# EAGLE design main (EAGLE 5.06)
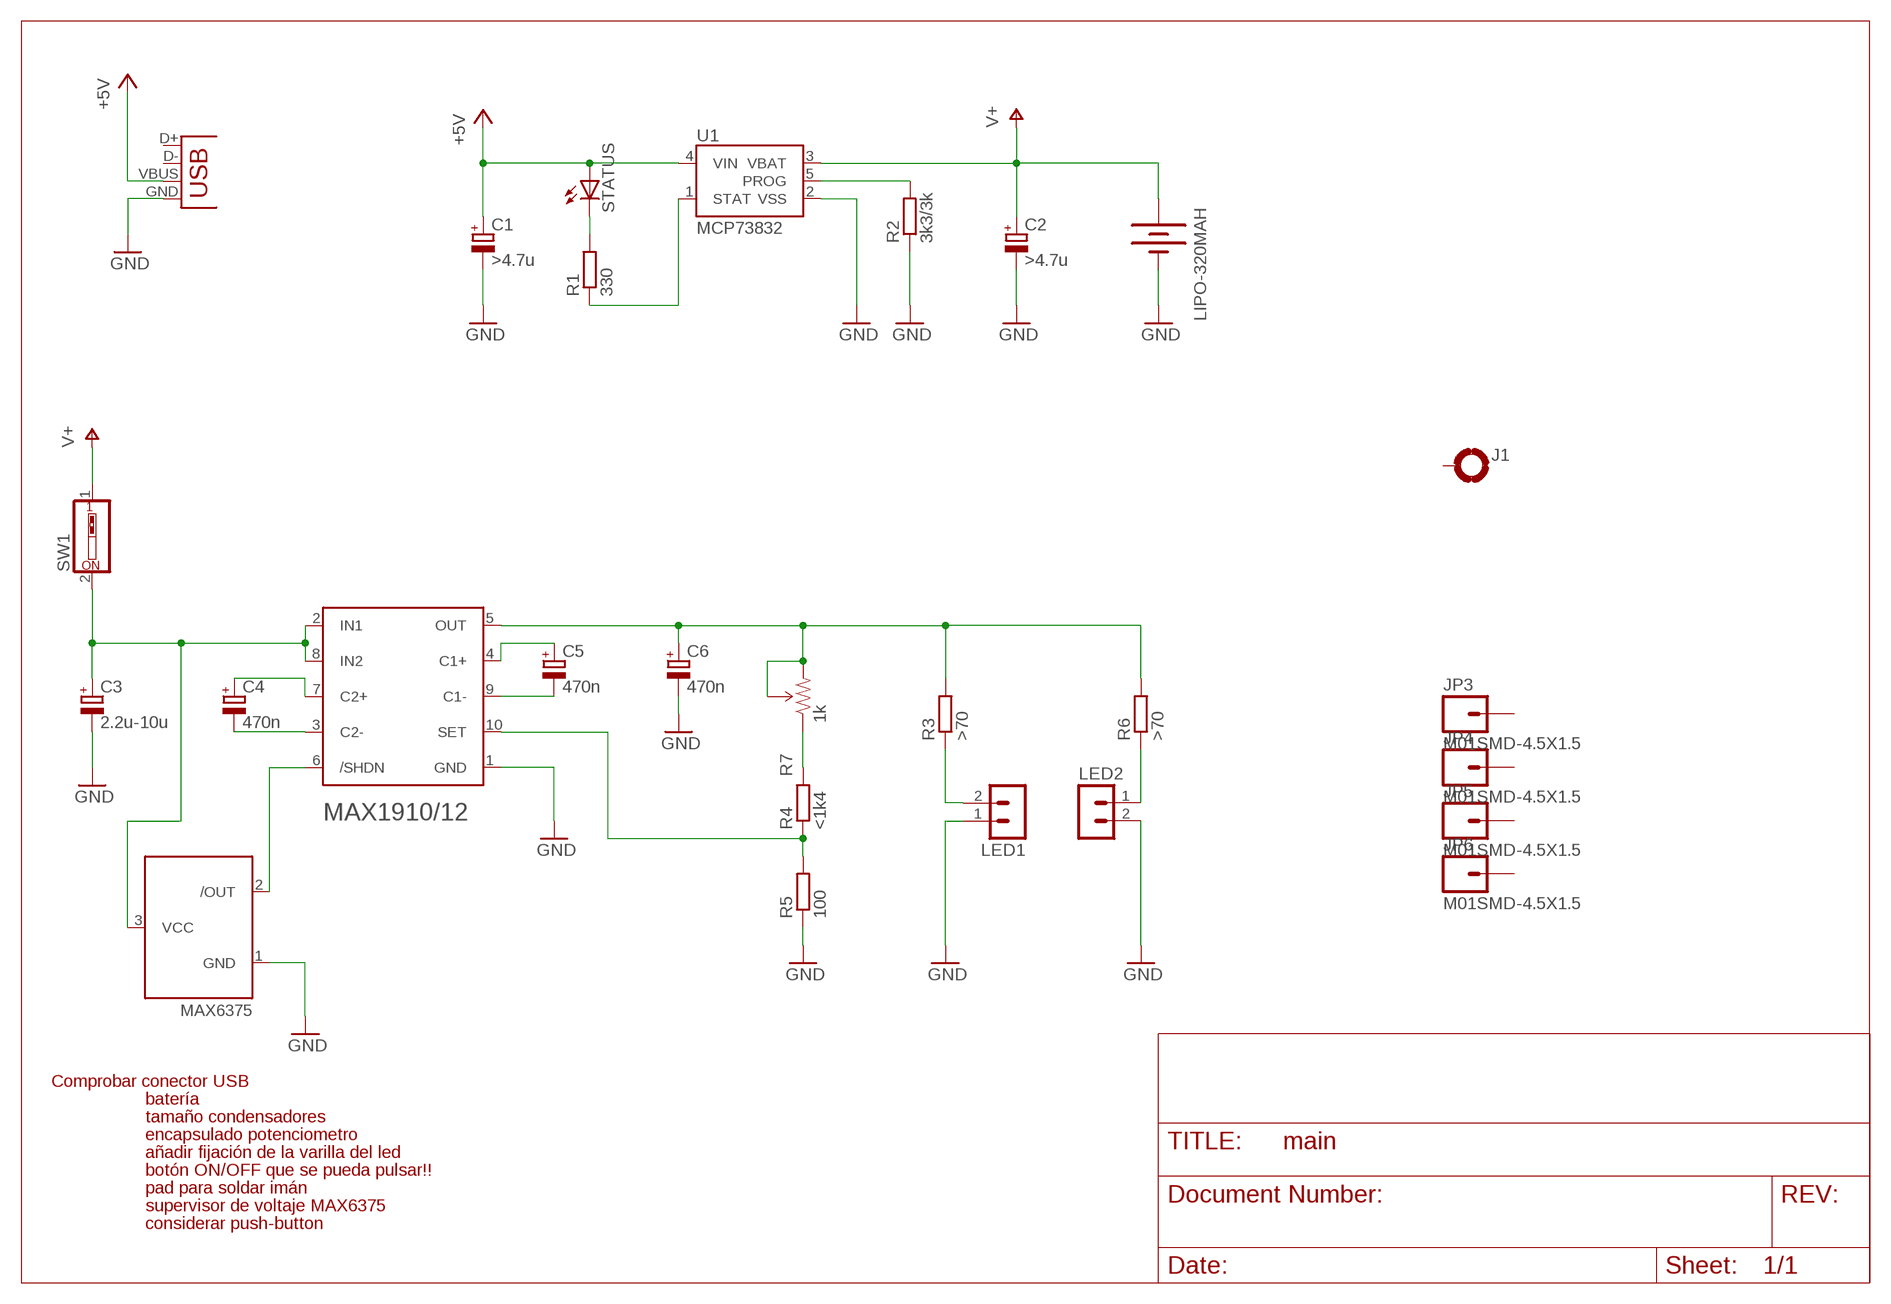
[diagram p0: schematic, sheet 1]

## Parts
C1  >4.7u  CPOL-EUSMCB  [SMC_B]
C2  >4.7u  CPOL-EUSMCB  [SMC_B]
C3  2.2u-10u  CPOL-EUSMCA  [SMC_A]
C4  470n  CPOL-EUSMCA  [SMC_A]
C5  470n  CPOL-EUSMCA  [SMC_A]
C6  470n  CPOL-EUSMCA  [SMC_A]
J1  STARBOARD_GND-SMALL2  [STARBOARD_GROUND_SMALL2]
JP3  M01SMD-4.5X1.5  [PAD-1.5X4.5]
JP4  M01SMD-4.5X1.5  [PAD-1.5X4.5]
JP5  M01SMD-4.5X1.5  [PAD-1.5X4.5]
JP6  M01SMD-4.5X1.5  [PAD-1.5X4.5]
LED1  MA02-1  [MA02-1W]
LED2  MA02-1  [MA02-1W]
LIPO-320MAH  BATTERY20PTH2  [BATTERY]
R1  330  R-EU_R1206  [R1206]
R2  3k3/3k  R-EU_R1206  [R1206]
R3  >70  R-EU_R1206  [R1206]
R4  <1k4  R-EU_R1206  [R1206]
R5  100  R-EU_R1206  [R1206]
R6  >70  R-EU_R1206  [R1206]
R7  1k  TRIMPOTPTH  [TRIM_POT_PTH]
STATUS  LEDCHIPLED_1206  [CHIPLED_1206]
SW1  SW_DIP-1  [EDG-01]
U1  MCP73832  [SOT23-5]
U$1  MAX1910/12  [UMAX/USOP_10L]
U$2  MAX6375  [SC70-3-W]
X3  USB-MICROB  [USB-MICROB]

## Nets
+5V: C1.+ STATUS.A U1.4(VIN) X3.VBUS
GND: C1.- C2.- C3.- C6.- LED1.1 LED2.2 LIPO-320MAH.- R2.1 R5.1 U1.2(VSS) U$1.1(GND) U$2.1(GND) X3.GND
N$1: C3.+ SW1.2 U$1.2(IN1) U$1.8(IN2) U$2.3(VCC)
N$2: R1.2 STATUS.C
N$3: R2.2 U1.5(PROG)
N$4: R1.1 U1.1(STAT)
N$5: C4.- U$1.3(C2-)
N$6: C4.+ U$1.7(C2+)
N$7: C5.- U$1.9(C1-)
N$8: C5.+ U$1.4(C1+)
N$9: LED2.1 R6.1
N$10: LED1.2 R3.1
N$11: C6.+ R3.2 R6.2 R7.2(WIPER) R7.3(CW) U$1.5(OUT)
N$12: R4.1 R5.2 U$1.10(SET)
N$13: R4.2 R7.1(CCW)
N$15: U$1.6(/SHDN) U$2.2(/OUT)
V+: C2.+ LIPO-320MAH.+ SW1.1 U1.3(VBAT)
Unconnected: J1.GROUND(MOUNT) JP3.P$1 JP4.P$1 JP5.P$1 JP6.P$1 X3.D+ X3.D-

## Notes on the sheet
- Comprobar conector USB
- batería
- tamaño condensadores
- encapsulado potenciometro
- añadir fijación de la varilla del led
- botón ON/OFF que se pueda pulsar!!
- pad para soldar imán
- supervisor de voltaje MAX6375
- considerar push-button

## Library data of the parts
C1-C6 = rcl:CPOL-EU: POLARIZED CAPACITOR, European symbol
J1 = SparkFun:STARBOARD_GND: StarBoard ground Pad Starboard pads sans the star cutout in top layer
JP3-JP6 = SparkFun:M01: Header 1 Standard 1-pin 0.1" header. Use with straight break away headers (SKU : PRT-00116), right angle break away headers (PRT-00553), swiss pins (PRT-00743), machine pins (PRT-00117), and female headers (PRT-00115).
LED1 LED2 = dan:MA02-1
LIPO-320MAH = SparkFun:BATTERY: Battery Holders Various common sizes : AA, AAA, 20mm coin cell and 12mm coin cell.
R1-R6 = rcl:R-EU_: RESISTOR, European symbol
R7 = SparkFun:TRIMPOT
STATUS = led:LED: LED OSRAM: - CHIPLED LG R971, LG N971, LY N971, LG Q971, LY Q971, LO R971, LY R971 LH N974, LH R974 LS Q976, LO Q976, LY Q976 LO Q996 - Hyper CHIPLED LW Q18S LB Q993, LB Q99A, LB R99A - SideLED LS A670, LO A670, LY A670, LG A670, LP A670 LB A673, LV A673, LT A673, LW A673 LH A674 LY A675 LS A676, LA A676, LO A676, LY A676, LW A676 LS A679, LY A679, LG A679 - Hyper Micro SIDELED® LS Y876, LA Y876, LO Y876, LY Y876 LT Y87S - SmartLED LW L88C, LW L88S LB L89C, LB L89S, LG L890 LS L89K, LO L89K, LY L89K LS L896, LA L896, LO L896, LY L896 - TOPLED LS T670, LO T670, LY T670, LG T670, LP T670 LSG T670, LSP T670, LSY T670, LOP T670, LYG T670 LG T671, LOG T671, LSG T671 LB T673, LV T673, LT T673, LW T673 LH T674 LS T676, LA T676, LO T676, LY T676, LB T676, LH T676, LSB T676, LW T676 LB T67C, LV T67C, LT T67C, LS T67K, LO T67K, LY T67K, LW E67C LS E67B, LA E67B, LO E67B, LY E67B, LB E67C, LV E67C, LT E67C LW T67C LS T679, LY T679, LG T679 LS T770, LO T770, LY T770, LG T770, LP T770 LB T773, LV T773, LT T773, LW T773 LH T774 LS E675, LA E675, LY E675, LS T675 LS T776, LA T776, LO T776, LY T776, LB T776 LHGB T686 LT T68C, LB T68C - Hyper Mini TOPLED® LB M676 - Mini TOPLED Santana® LG M470 LS M47K, LO M47K, LY M47K Source: http://www.osram.convergy.de LUXEON: - LUMILED® LXK2-PW12-R00, LXK2-PW12-S00, LXK2-PW14-U00, LXK2-PW14-V00 LXK2-PM12-R00, LXK2-PM12-S00, LXK2-PM14-U00 LXK2-PE12-Q00, LXK2-PE12-R00, LXK2-PE12-S00, LXK2-PE14-T00, LXK2-PE14-U00 LXK2-PB12-K00, LXK2-PB12-L00, LXK2-PB12-M00, LXK2-PB14-N00, LXK2-PB14-P00, LXK2-PB14-Q00 LXK2-PR12-L00, LXK2-PR12-M00, LXK2-PR14-Q00, LXK2-PR14-R00 LXK2-PD12-Q00, LXK2-PD12-R00, LXK2-PD12-S00 LXK2-PH12-R00, LXK2-PH12-S00 LXK2-PL12-P00, LXK2-PL12-Q00, LXK2-PL12-R00 Source: www.luxeon.com KINGBRIGHT: KA-3528ASYC Source: www.kingbright.com
SW1 = special:SW_DIP-1: DIP SWITCH
U1 = dan:MCP73832: Microchip's MCP73832 Miniature single cell, fully integrated Li-Ion, Li-polymer charge management controller http://ww1.microchip.com/downloads/en/DeviceDoc/21984a.pdf
U$1 = dan:MAX1910/12: MAX1910/12 1.5X/2X High-Efficiency White LED Charge Pumps
U$2 = dan:MAX6375: MAX6375 3 pin, ultra-low-power sc70/sot23 voltage detectors
X3 = SparkFun:USB: USB Connectors USB-B-PTH is fully proven SKU : PRT-00139 USB-miniB is fully proven SKU : PRT-00587 USB-A-PCB is untested. USB-A-H is throughly reviewed, but untested. Spark Fun Electronics SKU : PRT-00437 USB-B-SMT is throughly reviewed, but untested. Needs silkscreen touching up. USB-A-S has not been used/tested USB-MB-H has not been used/tested

## Board
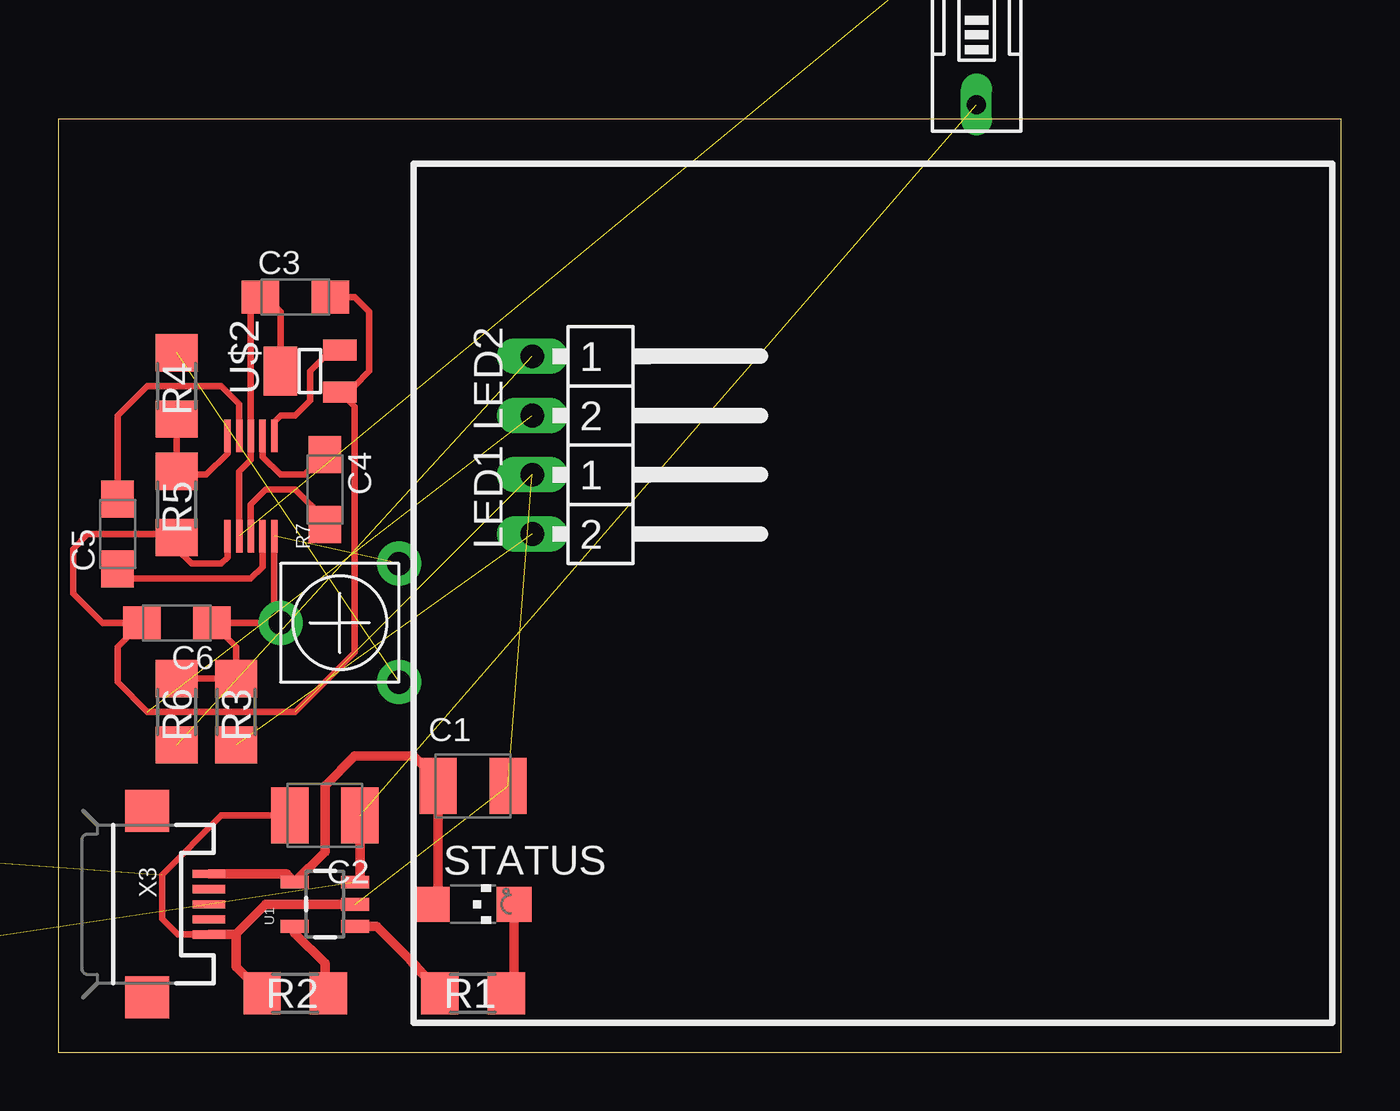
[diagram p1: board, top side]

Size 55 x 40 mm. Coordinates in mm from the lower left corner, seen from the top.
Outline: 0,0 55,0 55,40 0,40 0,0
Copper layers (1*16): Top 0.035mm / dielectric 1.5mm / Bottom 0.035mm
Design rules "default": minimum track width 10mil, minimum drill 24mil, track to track 8mil, track to pad 8mil, pad to pad 8mil, via to via 8mil, smd to smd 8mil, copper to edge 40mil, drill to drill 8mil, minimum pad ring 10mil, minimum via ring 8mil, stop-mask expansion 4mil, vias tented up to drill 0mil, thermal gap 10mil

### Footprints (pad centres in the part's own frame; a part is rotated, then mirrored left to right if it is on the bottom)
SMC_B = smd 1.6 x 2.4: + -1.5,0; - 1.5,0
SMC_A = smd 1.6 x 1.4: + -1.5,0; - 1.5,0
STARBOARD_GROUND_SMALL2 = smd 0.635 x 1.27: GROUND 0,5.271
PAD-1.5X4.5 = smd 1.5 x 2: P$1 0,0
MA02-1W = drill 1.016 long: 1 -1.27,-2.54; 2 1.27,-2.54
BATTERY = drill 1.016 long: + 9.525,-5.08; +@1 9.525,5.08; - -5.715,0
R1206 = smd 1.6 x 1.803: 1 -1.422,0; 2 1.422,0
TRIM_POT_PTH = drill 1 pad 1.88 round: 1 -2.54,-2.54; 2 0,2.54; 3 2.54,-2.54
CHIPLED_1206 = smd 1.5 x 1.5: A 0,-1.75; C 0,1.75
EDG-01 = drill 0.813 long: 1 0,-3.81; 2 0,3.81
SOT23-5 = smd 0.55 x 1.2: 1 -0.95,-1.3; 2 0,-1.3; 3 0.95,-1.3; 4 0.95,1.3; 5 -0.95,1.3
UMAX/USOP_10L = smd 1.4 x 0.28: 1 -2,1; 2 -2,0.5; 3 -2,0; 4 -2,-0.5; 5 -2,-1; 6 2.3,-1; 7 2.3,-0.5; 8 2.3,0; 9 2.3,0.5; 10 2.3,1
SC70-3-W = smd 0.9 x 1.45: 1 -0.9,-1.275; 2 0.9,-1.275 | smd 2.1 x 1.45: 3 0,1.275
USB-MICROB = smd 0.35 x 1.4: D+ 0,2.65; D- -0.65,2.65; GND 1.3,2.65; ID 0.65,2.65; VBUS -1.3,2.65 | smd 1.8 x 1.9: MT1 -4,0; MT2 4,0

### Placement (x,y rotation side)
C1  17.78,11.43 0 top
C2  11.43,10.16 180 top
C3  10.16,32.38 0 top
C4  11.43,24.13 270 top
C5  2.54,22.23 90 top
C6  5.08,18.41 180 top
J1  -24.13,25.4 0 top  (outside the outline)
JP3  -16.51,50.8 0 top  (outside the outline)
JP4  -19.05,50.8 0 top  (outside the outline)
JP5  -21.59,50.8 0 top  (outside the outline)
JP6  -24.13,50.8 0 top  (outside the outline)
LED1  22.86,23.5 270 top
LED2  22.86,28.57 270 top
LIPO-320MAH  -15.88,9.53 0 top  (outside the outline)
R1  17.78,2.54 0 top
R2  10.16,2.54 0 top
R3  7.62,14.61 90 top
R4  5.08,28.57 90 top
R5  5.08,23.5 90 top
R6  5.08,14.61 90 top
R7  12.06,18.41 90 top
STATUS  17.78,6.35 270 top
SW1  39.37,44.45 0 top
U1  11.43,6.35 90 top
U$1  8.26,24.13 90 top
U$2  10.79,29.21 90 top
X3  3.81,6.35 270 top

### Tracks (layer width: path | path; a pad name or v marks a point on that pad's centre or on a via)
+5V
  Top 0.406: X3.VBUS 9.78,7.65 U1.4 11.43,8.6 11.43,11.43 12.7,12.7 15.24,12.7 16.28,11.66 C1.+ 16.28,6.6 STATUS.A
GND  (5 unrouted)
  Top 0.279: R5.1 5.14,22.13 | U$1.1 7.25,21.23 6.99,20.95 5.71,20.95 5.08,21.59 R5.1 | R5.1 4.93,22.23 1.27,22.23 0.64,21.59 0.64,19.68 1.91,18.41 C6.- 2.54,17.38 2.54,15.88 3.81,14.61 10.16,14.61 12.7,17.14 12.7,27.68 U$2.1 12.34,28.57 12.7,28.57 13.34,29.21 13.34,31.75 12.7,32.38 C3.- | X3.GND 5.11,5.05 4.45,5.71 4.45,7.62 6.99,10.16 C2.-
  Top 0.406: U1.2 8.89,6.35 7.62,5.08 | 7.62,5.08 7.59,5.05 X3.GND | R2.1 7.62,3.66 7.62,5.08
N$1  (1 unrouted)
  Top 0.279: U$1.2 7.75,24.9 8.26,25.4 U$1.8 8.26,32.38 C3.+ 8.89,32.38 9.53,31.75 U$2.3
N$2
  Top 0.406: R1.2 19.53,2.87 STATUS.C
N$3
  Top 0.406: R2.2 11.43,2.69 11.43,3.81 10.13,5.11 U1.5
N$4
  Top 0.406: U1.1 13.65,5.4 15.09,3.96 R1.1
N$5
  Top 0.279: U$1.3 8.26,23.5 8.89,24.13 10.16,24.13 11.43,22.86 C4.-
N$6
  Top 0.279: U$1.7 8.76,25.54 9.53,24.77 10.56,24.77 C4.+
N$7
  Top 0.279: U$1.9 7.75,27.8 6.99,28.57 3.81,28.57 2.54,27.3 C5.-
N$8
  Top 0.279: U$1.4 8.76,20.82 8.26,20.32 2.94,20.32 C5.+
N$9  (1 unrouted)
N$10  (1 unrouted)
N$11  (1 unrouted)
  Top 0.279: U$1.5 9.26,18.68 R7.2 C6.+ 7.62,17.38 R3.2 R6.2
N$12
  Top 0.279: U$1.10 7.25,25.67 6.35,24.77 5.23,24.77 R5.2 R4.1
N$13  (1 unrouted)
N$15
  Top 0.279: U$2.2 11.8,29.84 11.43,29.84 10.79,29.21 10.79,27.94 10.16,27.3 9.53,27.3 9.26,27.04 U$1.6
V+  (2 unrouted)
  Top 0.406: U1.3 12.93,7.3 C2.+